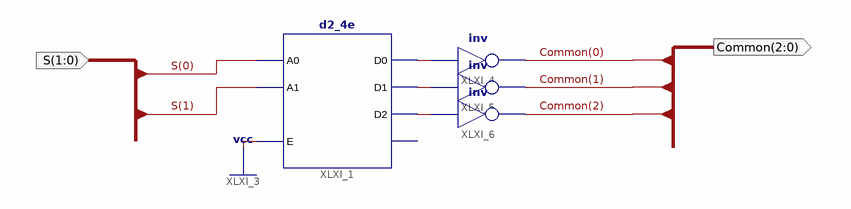
[diagram p0: schematic sheet 1]
// Xilinx ISE schematic Decoder1_3.sch (spartan6) as structural Verilog: 4 symbols, 2 ports
module Decoder1_3 (
  input  [1:0] S,
  output [2:0] Common
);

  wire XLXN_14, XLXN_15, XLXN_16;

  d2_4e XLXI_1 (.A0(S[0]), .A1(S[1]), .E(1'b1), .D0(XLXN_14), .D1(XLXN_15), .D2(XLXN_16));  // open: D3
  not XLXI_4 (Common[0], XLXN_14);
  not XLXI_5 (Common[1], XLXN_15);
  not XLXI_6 (Common[2], XLXN_16);
endmodule
